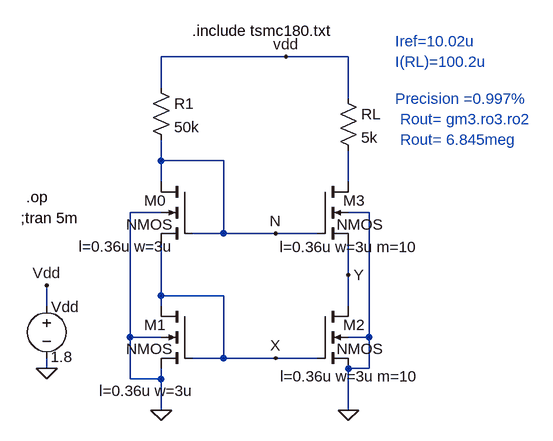
[diagram p0: schematic Cascode current mirror_with_Ref.asc]
Cascode current mirror_with_Ref.asc, the LTspice schematic file:
Version 4
SHEET 1 1304 692
WIRE 544 64 352 64
WIRE 640 64 544 64
WIRE 352 112 352 64
WIRE 640 128 640 64
WIRE 352 224 352 192
WIRE 448 224 352 224
WIRE 352 256 352 224
WIRE 640 256 640 208
WIRE 352 304 304 304
WIRE 672 304 640 304
WIRE 448 336 448 224
WIRE 448 336 400 336
WIRE 528 336 448 336
WIRE 592 336 528 336
WIRE 640 400 640 352
WIRE 352 432 352 352
WIRE 448 432 352 432
WIRE 176 448 176 416
WIRE 352 448 352 432
WIRE 640 448 640 400
WIRE 304 496 304 304
WIRE 352 496 304 496
WIRE 672 496 672 304
WIRE 672 496 640 496
WIRE 448 528 448 432
WIRE 448 528 400 528
WIRE 528 528 448 528
WIRE 592 528 528 528
WIRE 176 544 176 528
WIRE 672 544 672 496
WIRE 672 544 640 544
WIRE 304 560 304 496
WIRE 352 560 352 544
WIRE 352 560 304 560
WIRE 352 608 352 560
WIRE 640 608 640 544
FLAG 176 416 Vdd
FLAG 544 64 vdd
FLAG 528 336 N
FLAG 640 400 Y
FLAG 528 528 X
FLAG 176 544 0
FLAG 352 608 0
FLAG 640 608 0
SYMBOL voltage 176 432 R0
WINDOW 123 0 0 Left 0
WINDOW 39 0 0 Left 0
WINDOW 0 7 17 Left 2
WINDOW 3 6 94 Left 2
SYMATTR InstName Vdd
SYMATTR Value 1.8
SYMBOL nmos4 592 448 R0
WINDOW 0 40 29 Left 2
WINDOW 3 30 66 Left 2
WINDOW 123 157 108 Right 2
SYMATTR InstName M2
SYMATTR Value2 l=0.36u w=3u m=10
SYMBOL nmos4 400 448 M0
WINDOW 0 40 29 Left 2
WINDOW 3 30 66 Left 2
WINDOW 123 143 130 Right 2
SYMATTR InstName M1
SYMATTR Value2 l=0.36u w=3u
SYMBOL nmos4 400 256 M0
WINDOW 0 40 29 Left 2
WINDOW 3 30 66 Left 2
WINDOW 123 175 100 Right 2
SYMATTR InstName M0
SYMATTR Value2 l=0.36u w=3u
SYMBOL nmos4 592 256 R0
WINDOW 0 40 29 Left 2
WINDOW 3 30 66 Left 2
WINDOW 123 156 101 Right 2
SYMATTR InstName M3
SYMATTR Value2 l=0.36u w=3u m=10
SYMBOL res 624 112 R0
SYMATTR InstName RL
SYMATTR Value 5k
SYMBOL res 336 96 R0
SYMATTR InstName R1
SYMATTR Value 50k
TEXT 400 24 Left 2 !.include tsmc180.txt
TEXT 144 280 Left 2 !.op
TEXT 136 312 Left 2 !;tran 5m
TEXT 720 160 Left 2 ;Rout= gm3.ro3.ro2\nRout= 6.845meg
TEXT 712 128 Left 2 ;Precision =0.997%
TEXT 712 40 Left 2 ;Iref=10.02u\nI(RL)=100.2u

The netlist it stands for:
* Cascode current mirror_with_Ref.asc
Vdd Vdd 0 1.8
M2 Y X 0 0 NMOS l=0.36u w=3u m=10
M1 X X 0 0 NMOS l=0.36u w=3u
M0 N N X 0 NMOS l=0.36u w=3u
M3 N001 N Y 0 NMOS l=0.36u w=3u m=10
RL Vdd N001 5k
R1 Vdd N 50k
.model NMOS NMOS
.model PMOS PMOS
.lib standard.mos
.include tsmc180.txt
.op
;tran 5m
* Rout= gm3.ro3.ro2
* Rout= 6.845meg
* Precision =0.997%
* Iref=10.02u
* I(RL)=100.2u
.backanno
.end